# EAGLE design DmxI2C (EAGLE 6.1)
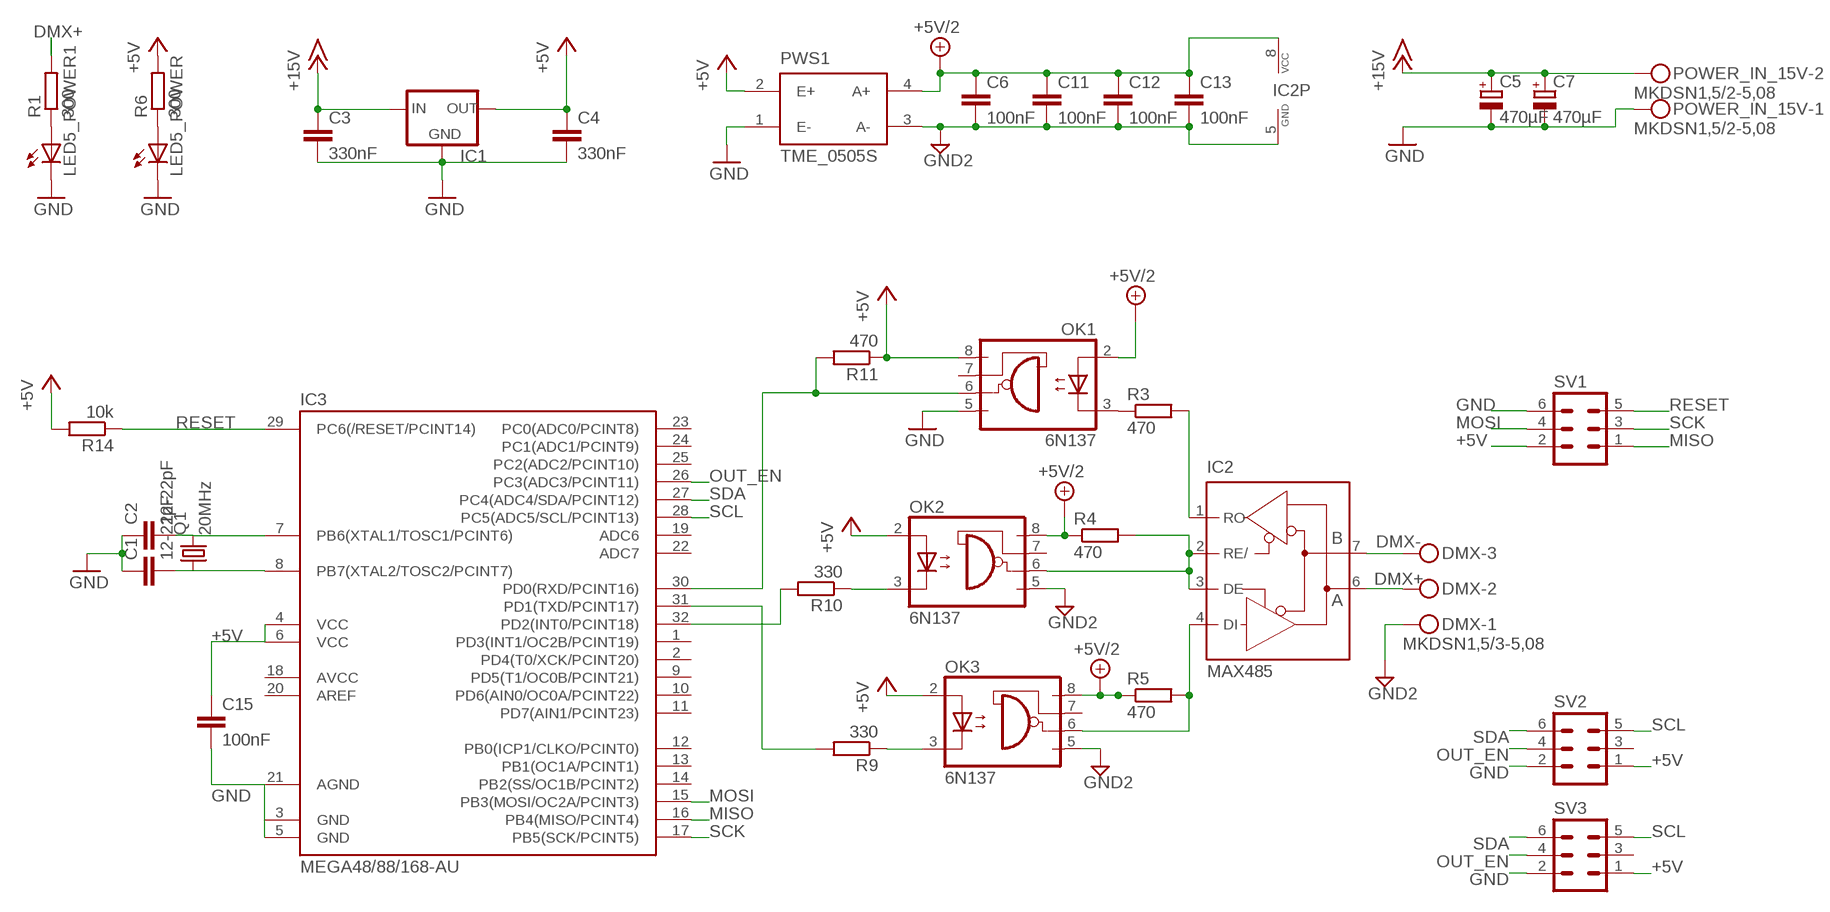
[diagram p0: schematic, sheet 1]

## Parts
C1  12-22pF  C-EUC0805  [C0805]
C2  12-22pF  C-EUC0805  [C0805]
C3  330nF  C-EUC0805  [C0805]
C4  330nF  C-EU050-025X075  [C050-025X075]
C5  470µF  CPOL-EUE2.5-6  [E2,5-6]
C6  100nF  C-EUC0805  [C0805]
C7  470µF  CPOL-EUE2.5-6  [E2,5-6]
C11  100nF  C-EUC0805  [C0805]
C12  100nF  C-EUC0805  [C0805]
C13  100nF  C-EUC0805  [C0805]
C15  100nF  C-EUC0805  [C0805]
DMX  MKDSN1,5/3-5,08  [MKDSN1,5/3-5,08]
IC1  78XXL  [78XXL]
IC2  MAX485  MAX481CPA  [DIL08]
IC3  MEGA48/88/168-AU  [TQFP32-08]
LED5_POWER  LED3MM  [LED3MM]
LED5_POWER1  LED3MM  [LED3MM]
OK1  6N137  [DIL08]
OK2  6N137  [DIL08]
OK3  6N137  [DIL08]
POWER_IN_15V  MKDSN1,5/2-5,08  [MKDSN1,5/2-5,08]
PWS1  TME_0505S  [TMEXXXXS]
Q1  20MHz  CRYSTALHC49UP  [HC49UP]
R1  300  R-EU_R0805  [R0805]
R3  470  R-EU_R0805  [R0805]
R4  470  R-EU_R0805  [R0805]
R5  470  R-EU_R0805  [R0805]
R6  300  R-EU_R0805  [R0805]
R9  330  R-EU_R0805  [R0805]
R10  330  R-EU_R0805  [R0805]
R11  470  R-EU_R0805  [R0805]
R14  10k  R-EU_R0805  [R0805]
SV1  MA03-2  [MA03-2]
SV2  MA03-2  [MA03-2]
SV3  MA03-2  [MA03-2]

## Nets
+5V [+5V]: C4.1 C15.1 IC1.OUT IC3.4(VCC) IC3.6(VCC) OK1.8(VCC) OK2.2(A) OK3.2(A) PWS1.2(E+) R6.2 R11.1 R14.2 SV1.2 SV2.1 SV3.1
+5V/2 [+5V]: C6.1 C11.1 C12.1 C13.1 IC2.8(VCC) OK1.2(A) OK2.8(VCC) OK3.8(VCC) PWS1.4(A+) R4.1 R5.1
+15V [+15V]: C3.1 C5.+ C7.+ IC1.IN POWER_IN_15V.2
DMX+ [dmx]: DMX.2 IC2.6(A) R1.2
DMX- [dmx]: DMX.3 IC2.7(B)
GND [GND]: C1.1 C2.1 C3.2 C4.2 C5.- C7.- C15.2 IC1.GND IC3.21(AGND) LED5_POWER1.K(C) LED5_POWER.K(C) OK1.5(GND) POWER_IN_15V.1 PWS1.1(E-) SV1.6 SV2.2 SV3.2
GND2 [GND]: C6.2 C11.2 C12.2 C13.2 DMX.1 IC2.5(GND) OK2.5(GND) OK3.5(GND) PWS1.3(A-)
MISO: IC3.16(PB4(MISO/PCINT4)) SV1.1
MOSI: IC3.15(PB3(MOSI/OC2A/PCINT3)) SV1.4
N$1: OK1.3(C) R3.1
N$2: IC2.1(RO) R3.2
N$3: IC2.2(RE/) IC2.3(DE) OK2.6(VO) R4.2
N$4: IC2.4(DI) OK3.6(VO) R5.2
N$5: OK3.3(C) R9.1
N$6: OK2.3(C) R10.1
N$7: IC3.30(PD0(RXD/PCINT16)) OK1.6(VO) R11.2
N$8: IC3.32(PD2(INT0/PCINT18)) R10.2
N$9: C2.2 IC3.7(PB6(XTAL1/TOSC1/PCINT6)) Q1.2
N$10: LED5_POWER1.A R1.1
N$12: IC3.31(PD1(TXD/PCINT17)) R9.2
N$18: C1.2 IC3.8(PB7(XTAL2/TOSC2/PCINT7)) Q1.1
N$20: LED5_POWER.A R6.1
OUT_EN: IC3.26(PC3(ADC3/PCINT11)) SV2.4 SV3.4
RESET: IC3.29(PC6(/RESET/PCINT14)) R14.1 SV1.5
SCK: IC3.17(PB5(SCK/PCINT5)) SV1.3
SCL: IC3.28(PC5(ADC5/SCL/PCINT13)) SV2.5 SV3.5
SDA: IC3.27(PC4(ADC4/SDA/PCINT12)) SV2.6 SV3.6
Unconnected: IC3.1(PD3(INT1/OC2B/PCINT19)) IC3.2(PD4(T0/XCK/PCINT20)) IC3.9(PD5(T1/OC0B/PCINT21)) IC3.10(PD6(AIN0/OC0A/PCINT22)) IC3.11(PD7(AIN1/PCINT23)) IC3.12(PB0(ICP1/CLKO/PCINT0)) IC3.13(PB1(OC1A/PCINT1)) IC3.14(PB2(SS/OC1B/PCINT2)) IC3.18(AVCC) IC3.19(ADC6) IC3.20(AREF) IC3.22(ADC7) IC3.23(PC0(ADC0/PCINT8)) IC3.24(PC1(ADC1/PCINT9)) IC3.25(PC2(ADC2/PCINT10)) OK1.7(VE) OK2.7(VE) OK3.7(VE) SV2.3 SV3.3

## Power pins joined to a net without a drawn wire
GND: IC3.3(GND) IC3.5(GND)

## Library data of the parts
C1-C4 C6 C11-C13 C15 = rcl:C-EU: CAPACITOR, European symbol
C5 C7 = rcl:CPOL-EU: POLARIZED CAPACITOR, European symbol
DMX = con-phoenix-508:MKDSN1,5/3-5,08: MKDSN 1,5/ 3-5,08 Printklemme Nennstrom: 13,5 A Nennspannung: 250 V Rastermaß: 5,08 mm Polzahl: 3 Anschlussart: Schraubanschluss Montage: Löten Anschlussrichtung Leiter/Platine: 0 ° Artikelnummer: 1729131 Source: http://eshop.phoenixcontact.com .. 1729131.pdf; MPN: SMKDSN1,5/3-5,08; OC_FARNELL: 1792904; OC_NEWARK: 70R0299
IC1 = v-reg:78XXL: VOLTAGE REGULATOR
IC2 = maxim:MAX481CPA: RS485 TRANSEIVER; MPN: MAX485; OC_FARNELL: unknown; OC_NEWARK: 99K3445
IC3 = avr-6:MEGA48/88/168
LED5_POWER LED5_POWER1 = led:LED: LED OSRAM: - CHIPLED LG R971, LG N971, LY N971, LG Q971, LY Q971, LO R971, LY R971 LH N974, LH R974 LS Q976, LO Q976, LY Q976 LO Q996 - Hyper CHIPLED LW Q18S LB Q993, LB Q99A, LB R99A - SideLED LS A670, LO A670, LY A670, LG A670, LP A670 LB A673, LV A673, LT A673, LW A673 LH A674 LY A675 LS A676, LA A676, LO A676, LY A676, LW A676 LS A679, LY A679, LG A679 - Hyper Micro SIDELED® LS Y876, LA Y876, LO Y876, LY Y876 LT Y87S - SmartLED LW L88C, LW L88S LB L89C, LB L89S, LG L890 LS L89K, LO L89K, LY L89K LS L896, LA L896, LO L896, LY L896 - TOPLED LS T670, LO T670, LY T670, LG T670, LP T670 LSG T670, LSP T670, LSY T670, LOP T670, LYG T670 LG T671, LOG T671, LSG T671 LB T673, LV T673, LT T673, LW T673 LH T674 LS T676, LA T676, LO T676, LY T676, LB T676, LH T676, LSB T676, LW T676 LB T67C, LV T67C, LT T67C, LS T67K, LO T67K, LY T67K, LW E67C LS E67B, LA E67B, LO E67B, LY E67B, LB E67C, LV E67C, LT E67C LW T67C LS T679, LY T679, LG T679 LS T770, LO T770, LY T770, LG T770, LP T770 LB T773, LV T773, LT T773, LW T773 LH T774 LS E675, LA E675, LY E675, LS T675 LS T776, LA T776, LO T776, LY T776, LB T776 LHGB T686 LT T68C, LB T68C - Hyper Mini TOPLED® LB M676 - Mini TOPLED Santana® LG M470 LS M47K, LO M47K, LY M47K Source: http://www.osram.convergy.de LUXEON: - LUMILED® LXK2-PW12-R00, LXK2-PW12-S00, LXK2-PW14-U00, LXK2-PW14-V00 LXK2-PM12-R00, LXK2-PM12-S00, LXK2-PM14-U00 LXK2-PE12-Q00, LXK2-PE12-R00, LXK2-PE12-S00, LXK2-PE14-T00, LXK2-PE14-U00 LXK2-PB12-K00, LXK2-PB12-L00, LXK2-PB12-M00, LXK2-PB14-N00, LXK2-PB14-P00, LXK2-PB14-Q00 LXK2-PR12-L00, LXK2-PR12-M00, LXK2-PR14-Q00, LXK2-PR14-R00 LXK2-PD12-Q00, LXK2-PD12-R00, LXK2-PD12-S00 LXK2-PH12-R00, LXK2-PH12-S00 LXK2-PL12-P00, LXK2-PL12-Q00, LXK2-PL12-R00 Source: www.luxeon.com KINGBRIGHT: KA-3528ASYC Source: www.kingbright.com
OK1-OK3 = optocoupler:6N137: MOTOROLA OPTO COUPLER; MPN: 6N137; OC_FARNELL: 1328376; OC_NEWARK: 52M1895
POWER_IN_15V = con-phoenix-508:MKDSN1,5/2-5,08: MKDSN 1,5/ 2-5,08 Printklemme Nennstrom: 13,5 A Nennspannung: 250 V Rastermaß: 5,08 mm Polzahl: 2 Anschlussart: Schraubanschluss Montage: Löten Anschlussrichtung Leiter/Platine: 0 ° Artikelnummer: 1729128 Source: http://eshop.phoenixcontact.com .. 1729128.pdf; MPN: MKDSN 1,5/2-5.08; OC_FARNELL: 1792903; OC_NEWARK: 30M2397
PWS1 = traco-electronic:TME_*S: DC/DC Konverter 1 Watt Source: http://www.tracopower.com/datasheet_g/tme-d.pdf; MPN: TME 0505S; OC_FARNELL: 1007538; OC_NEWARK: 51R5321
Q1 = adafruit:CRYSTAL: CRYSTAL; OC_FARNELL: unknown; OC_NEWARK: unknown
R1 R3-R6 R9-R11 R14 = rcl:R-EU_: RESISTOR, European symbol
SV1-SV3 = con-lstb:MA03-2: PIN HEADER; OC_FARNELL: unknown; OC_NEWARK: unknown

## Net classes
0 default: width 0.406 mm, drill 0.254 mm, clearance 0.254 mm
1 +5V: width 0.813 mm, drill 0.406 mm, clearance 0.406 mm
2 +15V: width 0.813 mm, drill 0.406 mm, clearance 0.406 mm
3 screw: clearance 1.016 mm
4 dmx: width 0.508 mm, drill 0.254 mm, clearance 0.406 mm
5 GND: width 0.813 mm, drill 0.406 mm, clearance 0.406 mm

## Board
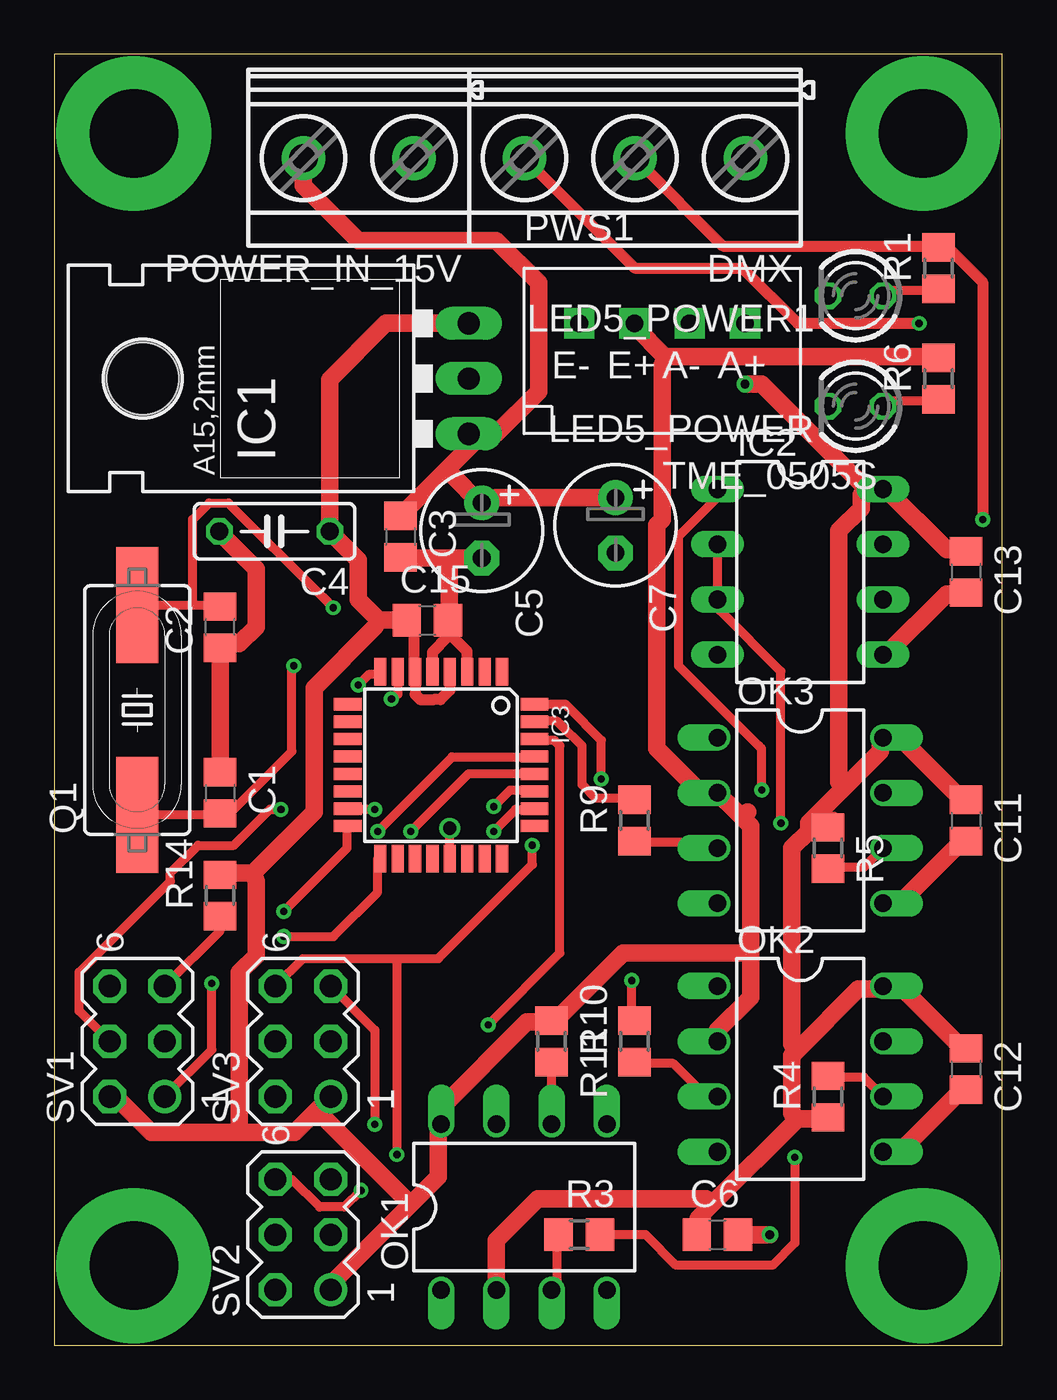
[diagram p1: board, top side]
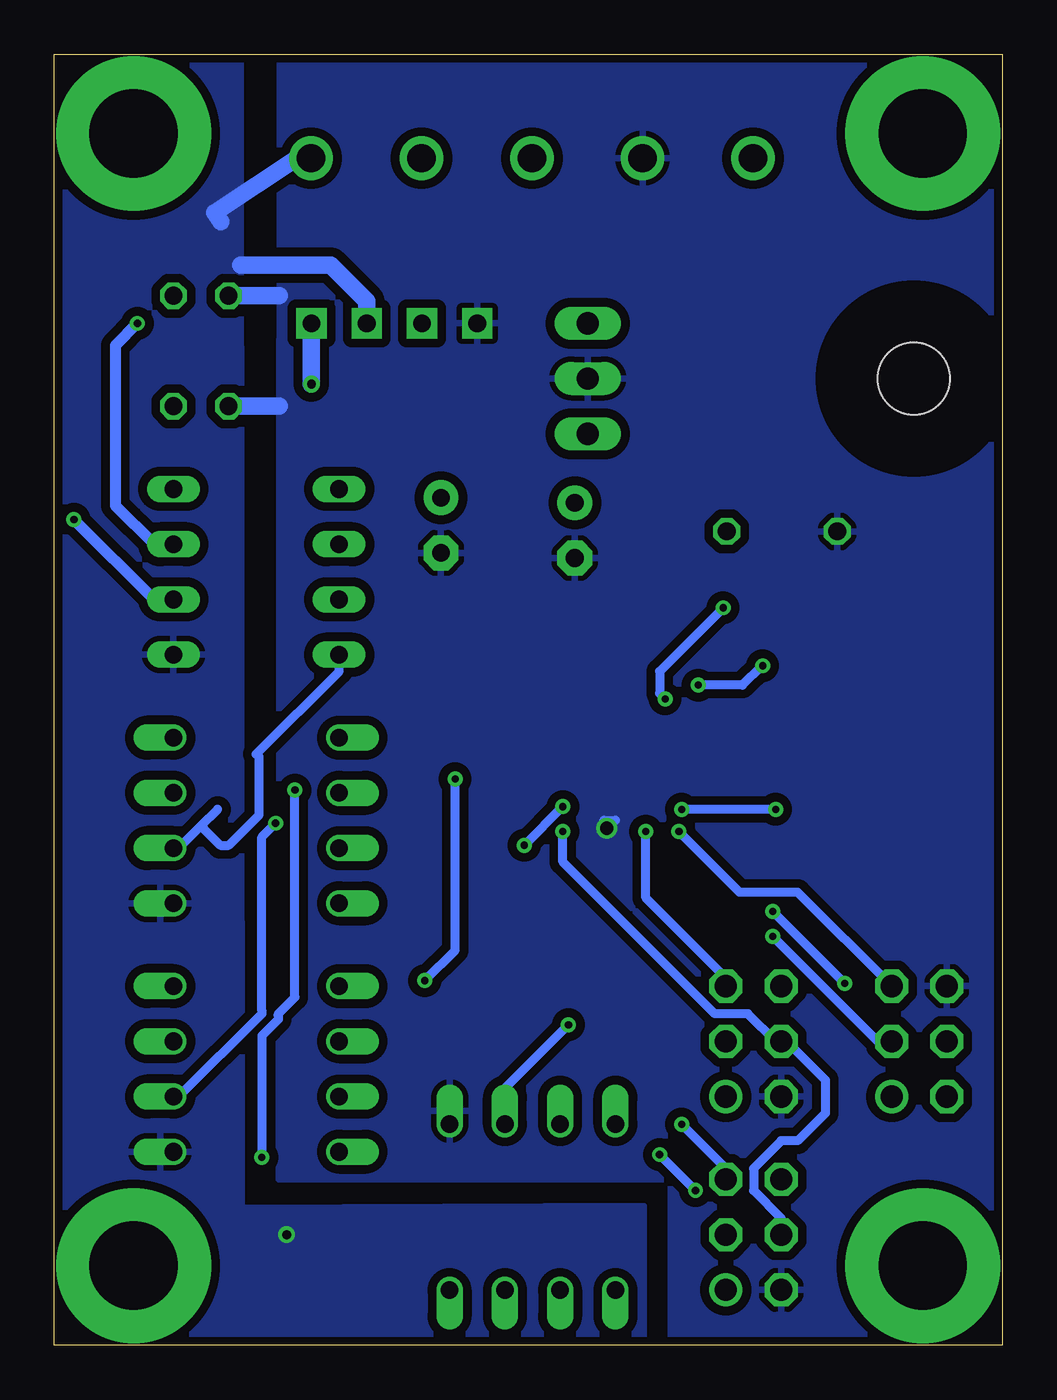
[diagram p2: board, bottom side, seen from below]

Size 43.57 x 59.36 mm. Coordinates in mm from the lower left corner, seen from the top.
Outline: 0,0 43.57,0 43.57,59.36 0,59.36 0,0
Copper layers (1*16): Top 0.0356mm / dielectric 1.5011mm / Bottom 0.0356mm
Design rules: minimum track width 16mil, minimum drill 13mil, track to track 6mil, track to pad 1mil, pad to pad 6mil, via to via 6mil, smd to smd 6mil, copper to edge 15mil, drill to drill 6mil, minimum pad ring 7mil, minimum via ring 7mil, stop-mask expansion 3mil, vias tented up to drill 0mil, thermal gap 10mil
vRestrict: area 0.6,39.2 to 16.6,49.8

### Footprints (pad centres in the part's own frame; a part is rotated, then mirrored left to right if it is on the bottom)
C0805 = smd 1.3 x 1.5: 1 -0.95,0; 2 0.95,0
C050-025X075 = drill 0.813 octagon: 1 -2.54,0; 2 2.54,0
E2,5-6 = drill 0.813 pad 1.6: + -1.27,0 | drill 0.813 pad 1.6 octagon: - 1.27,0
MKDSN1,5/3-5,08 = drill 1.3 pad 2: 1 -7.641,0.025; 2 -2.561,0.025; 3 2.519,0.025
78XXL = drill 1.016 long: GND 0,-3.81; IN -2.54,-3.81; OUT 2.54,-3.81 | hole 3.302: 0,11.176
DIL08 = drill 0.813 long: 1 -3.81,-3.81; 2 -1.27,-3.81; 3 1.27,-3.81; 4 3.81,-3.81; 5 3.81,3.81; 6 1.27,3.81; 7 -1.27,3.81; 8 -3.81,3.81
TQFP32-08 = smd 1.27 x 0.559: 1 -4.293,2.8; 2 -4.293,2; 3 -4.293,1.2; 4 -4.293,0.4; 5 -4.293,-0.4; 6 -4.293,-1.2; 7 -4.293,-2; 8 -4.293,-2.8; 17 4.293,-2.8; 18 4.293,-2; 19 4.293,-1.2; 20 4.293,-0.4; 21 4.293,0.4; 22 4.293,1.2; 23 4.293,2; 24 4.293,2.8 | smd 0.559 x 1.27: 9 -2.8,-4.293; 10 -2,-4.293; 11 -1.2,-4.293; 12 -0.4,-4.293; 13 0.4,-4.293; 14 1.2,-4.293; 15 2,-4.293; 16 2.8,-4.293; 25 2.8,4.293; 26 2,4.293; 27 1.2,4.293; 28 0.4,4.293; 29 -0.4,4.293; 30 -1.2,4.293; 31 -2,4.293; 32 -2.8,4.293
LED3MM = drill 0.813 octagon: A -1.27,0; K 1.27,0
DIL08' = drill 0.813 offset: 1 -3.81,-3.81; 2 -1.27,-3.81; 3 1.27,-3.81; 4 3.81,-3.81; 5 3.81,3.81; 6 1.27,3.81; 7 -1.27,3.81; 8 -3.81,3.81
MKDSN1,5/2-5,08 = drill 1.3 pad 2: 1 -2.561,0.025; 2 2.519,0.025
TMEXXXXS = drill 0.813 pad 1.397 square: 1 -3.81,1.27; 2 -1.27,1.27; 3 1.27,1.27; 4 3.81,1.27
HC49UP = smd 5.334 x 1.93: 1 -4.826,0; 2 4.826,0
R0805 = smd 1.3 x 1.5: 1 -0.95,0; 2 0.95,0
MA03-2 = drill 1.016: 1 -2.54,-1.27 | drill 1.016 octagon: 2 -2.54,1.27; 3 0,-1.27; 4 0,1.27; 5 2.54,-1.27; 6 2.54,1.27

### Placement (x,y rotation side)
C1  7.62,25.4 270 top
C2  7.62,33.02 90 top
C3  15.91,37.19 270 top
C4  10.12,37.43 180 top
C5  19.65,37.47 270 top
C6  30.48,5.08 0 top
C7  25.8,37.7 270 top
C11  41.91,24.13 270 top
C12  41.91,12.7 270 top
C13  41.91,35.56 270 top
C15  17.14,33.34 0 top
DMX  24.13,54.61 180 top
IC1  15.24,44.45 90 top
IC2  34.29,35.56 270 top
IC3  17.78,26.67 270 top
LED5_POWER  36.83,43.18 180 top
LED5_POWER1  36.83,48.26 180 top
OK1  6N137  [DIL08']  21.59,6.35 0 top
OK2  6N137  [DIL08']  34.29,12.7 270 top
OK3  6N137  [DIL08']  34.29,24.13 270 top
POWER_IN_15V  13.97,54.61 180 top
PWS1  27.94,45.72 0 top
Q1  3.81,29.21 90 top
R1  40.64,49.53 90 top
R3  24.13,5.08 0 top
R4  35.56,11.43 90 top
R5  35.56,22.86 270 top
R6  40.64,44.45 90 top
R9  26.67,24.13 90 top
R10  26.67,13.97 90 top
R11  22.86,13.97 270 top
R14  7.62,20.68 90 top
SV1  3.81,13.97 90 top
SV2  11.43,5.08 90 top
SV3  11.43,13.97 90 top

### Tracks (layer width: path | path; a pad name or v marks a point on that pad's centre or on a via)
+5V
  Top 0.508: C15.1 16.2,33.26 16.55,32.9 16.55,30.99 IC3.6 16.59,29.92 16.83,29.69 17.42,29.69 17.74,29.69 18.18,30.12 IC3.4
  Top 0.813: IC1.OUT 15.24,46.99 12.66,44.41 C4.1 13.97,36.12 13.97,34.29 14.92,33.34 | 14.92,33.34 C15.1 | 9.14,21.72 7.62,21.72 R14.2 | 9.14,21.72 11.94,24.51 11.94,30.23 14.73,33.02 14.92,33.34 | SV1.2 2.79,11.43 4.45,9.78 8.51,9.78 | 8.51,9.78 11.05,9.78 12.06,10.79 | SV3.1 12.06,10.79 | OK2.2 30.48,14.48 32,16 32,18.03 | 32,18.03 32,23.88 31.62,24.26 | SV2.1 12.7,2.79 16.38,6.48 | 16.38,6.48 17.65,7.75 17.65,9.78 OK1.8 17.78,10.92 21.72,14.86 22.86,14.86 R11.1 23.24,15.11 26.16,18.03 31.62,18.03 32,18.03 | 31.88,24.51 31.62,24.26 | 12.06,10.79 12.32,10.54 16.13,6.73 16.38,6.48 | 9.14,21.72 9.27,21.34 9.27,17.91 8.51,17.14 8.51,10.16 8.51,9.78 | 31.62,24.26 31.37,24.51 OK3.2 30.1,25.53 29.59,25.53 27.69,27.43 27.69,27.81 27.69,37.72 27.94,37.97 27.94,45.09 28.07,45.47 | 28.07,45.47 40.64,45.47 R6.2 | 28.07,45.47 26.67,46.86 PWS1.2
+5V/2  (via drill 0.41)
  Top 0.813: R5.1 35.56,23.75 R5.1 | 35.81,24.13 R5.1 | C12.1 41.91,13.72 41.66,13.72 38.86,16.51 OK2.8 37.72,16.38 36.96,16.38 34.16,13.59 | 34.16,10.41 30.23,6.48 | 30.23,6.48 29.59,5.84 29.59,5.08 C6.1 | 34.16,10.41 35.56,10.41 R4.1 | OK1.2 20.32,4.83 22.23,6.73 29.97,6.73 30.23,6.48 | 34.16,13.59 33.91,13.34 33.91,10.67 34.16,10.41 | 34.67,23.62 35.18,23.62 R5.1 | 34.67,23.62 33.91,22.86 33.91,13.84 34.16,13.59 | C11.1 41.91,25.15 41.66,25.15 38.86,27.94 OK3.8 37.97,27.56 37.97,27.3 36.32,25.65 | 36.32,25.65 34.67,24 34.67,23.62 | IC2.8 38.23,39.37 41.02,36.58 41.91,36.58 C13.1 | v31.75,44.2 32.51,44.2 37.21,39.5 37.72,39.5 IC2.8 | IC2.8 37.08,39.12 37.08,38.48 36.07,37.47 36.07,25.91 36.32,25.65
  Bottom 0.813: v31.75,44.2 PWS1.4
+15V
  Top 0.813: POWER_IN_15V.2 11.45,53.32 13.97,50.8 20.32,50.8 22.27,48.85 22.27,45.72 22.27,43.85 20.32,41.91 IC1.IN 19.3,41.53 18.03,40.26 | 18.03,40.26 16,38.23 C3.1 | C5.+ 19.56,38.73 18.29,40.01 18.03,40.26 | 19.94,38.99 C5.+ | C5.+ 20.32,38.99 20.7,38.99 25.78,38.99 C7.+
DMX+  (via drill 0.33)
  Top 0.508: DMX.2 26.8,54.48 30.73,50.55 40.64,50.55 R1.2 40.77,50.29 41.27,50.29 42.67,48.9 v42.67,37.97
  Bottom 0.508: IC2.6 38.99,34.29 v42.67,37.97
DMX-  (via drill 0.33)
  Top 0.508: v39.75,46.99 34.16,46.99 31.62,49.53 26.67,49.53 21.72,54.48 DMX.3
  Bottom 0.508: IC2.7 38.99,36.83 40.77,38.61 40.77,45.97 v39.75,46.99
GND  (via drill 0.6)
  Top 0.406: IC3.21 v18.18,23.77
  Top 0.508: IC3.5 17.38,31.87 18.09,32.58 | 18.09,32.58 C15.2 | IC3.3 18.97,30.97 18.97,31.91 18.3,32.58 18.09,32.58
  Top 0.813: C1.1 7.62,26.42 7.62,32 C2.1 8,32.26 8.51,32.26 9.27,33.02 9.27,35.69 7.62,37.34 C4.2 | 18.16,36.2 19.56,36.2 C5.- | 18.16,36.2 16,36.2 C3.2 | C15.2 18.16,33.53 18.16,35.81 18.16,36.2
  Bottom 0.406: v18.18,23.77 18.34,23.93 18.34,24.09 18.3,24.13 17.78,24.13
  Bottom 0.813: LED5_POWER.K 33.27,43.18 33.23,43.18 | LED5_POWER1.K 33.27,48.26 33.23,48.26
  pour Bottom (isolate 0.305): 0.16,0.16 0.16,59.17 33.22,59.17 33.26,7.62 15.24,7.62 15.24,0.16
GND2  (via drill 0.41)
  Top 0.813: v32.89,5.08 31.5,5.08 C6.2 | OK2.5 38.86,8.89 41.66,11.68 41.91,11.68 C12.2 | OK3.5 38.86,20.32 41.66,23.11 41.91,23.11 C11.2 | IC2.5 38.23,31.75 41.02,34.54 41.91,34.54 C13.2
  Bottom 0.813: PWS1.3 29.21,48.01 30.86,49.66 34.92,49.66 35,49.66 | DMX.1 31.88,54.61 32.38,54.61 36.2,52.07 35.92,51.67
  pour Bottom (isolate 0.305): 35,59.17 43.42,59.17 43.42,0.16 16.47,0.16 16.47,6.4 34.96,6.32
MISO  (via drill 0.33)
  Top 0.406: v10.54,19.94 13.46,22.86 13.46,23.75 IC3.16 | v7.24,16.64 7.24,13.59 SV1.1
  Bottom 0.406: v7.24,16.64 v10.54,19.94
MOSI  (via drill 0.33)
  Top 0.406: v14.73,24.64 13.59,24.64 IC3.15 | v10.41,24.64 9.91,24.64 8.26,22.99 6.6,22.99 5.33,21.72 5.33,21.34 1.14,17.14 1.14,15.37 SV1.4
  Bottom 0.406: v10.41,24.64 v14.73,24.64
N$1
  Top 0.406: OK1.3 23.11,2.79 23.11,5.08 R3.1
N$2  (via drill 0.33)
  Top 0.406: v34.04,8.64 34.04,4.7 33.02,3.68 28.57,3.68 27.18,5.08 25.15,5.08 R3.2 | v32.51,25.53 32.51,27.43 32.38,27.56 28.7,31.24 28.7,37.21 30.48,38.99 IC2.1
  Bottom 0.406: v34.04,8.64 34.04,14.22 33.27,14.99 33.27,15.11 33.27,15.24 32.51,16 v32.51,25.53
N$3  (via drill 0.33)
  Top 0.406: OK2.6 37.21,12.32 35.56,12.32 R4.2 | IC2.2 IC2.3 30.61,34.16 30.61,33.78 33.4,30.99 v33.4,24
  Bottom 0.406: OK2.6 37.85,11.43 34.04,15.24 34.04,15.37 34.04,23.37 v33.4,24
N$4
  Top 0.406: OK3.6 37.21,21.97 35.56,21.97 R5.2
  Bottom 0.406: 36.83,23.88 37.85,22.86 OK3.6 | 36.83,23.88 36.07,24.64 | 36.83,23.88 36.7,23.75 35.94,22.99 35.56,22.99 34.16,24.38 34.16,27.05 34.29,27.18 30.48,30.99 IC2.4
N$5
  Top 0.406: OK3.3 30.23,23.11 26.67,23.11 R9.1
N$6
  Top 0.406: OK2.3 29.97,11.43 28.45,12.95 26.67,12.95 R10.1
N$7  (via drill 0.33)
  Top 0.406: v19.94,14.73 23.24,18.03 23.24,27.56 22.99,27.81 22.1,27.81 IC3.30 | OK1.6 22.86,12.95 R11.2
  Bottom 0.406: v19.94,14.73 22.86,11.81 OK1.6
N$8  (via drill 0.33)
  Top 0.406: v26.54,16.76 26.54,15.11 26.67,14.99 R10.2 | IC3.32 22.1,29.46 23.5,29.46 23.62,29.34 25.15,27.81 v25.15,26.04
  Bottom 0.406: v25.15,26.04 25.15,18.16 v26.54,16.76
N$9  (via drill 0.33)
  Top 0.406: Q1.2 6.35,34.04 | 6.35,34.04 7.62,34.04 C2.2 | IC3.7 15.8,30.95 15.8,29.92 15.62,29.84 v15.49,29.72 | 6.35,34.04 6.35,34.16 6.35,37.97 7.11,38.73 8,38.73 12.19,34.54 12.32,34.42 v12.83,33.91
  Bottom 0.406: v15.49,29.72 15.75,29.97 15.75,30.99 v12.83,33.91
N$10
  Top 0.406: LED5_POWER1.A 38.35,48.51 40.64,48.51 R1.1
N$12
  Top 0.406: IC3.31 22.1,28.7 23.11,28.7 23.24,28.57 24.26,27.56 24.26,25.78 24.89,25.15 26.67,25.15 R9.2
N$18  (via drill 0.33)
  Top 0.406: v13.97,30.35 14.48,30.86 14.86,30.86 IC3.8 | 8.13,24.51 7.62,24.51 C1.2 | Q1.1 7.49,24.38 C1.2 | v11.01,31.24 10.92,31.24 10.92,27.3 8.26,24.64 C1.2
  Bottom 0.406: v13.97,30.35 11.94,30.35 11.05,31.24 v11.01,31.24
N$20
  Top 0.406: LED5_POWER.A 38.35,43.43 40.64,43.43 R6.1
N$21  (via drill 4.06 pad 7.11)
  other vias: 39.93,3.65
N$34  (via drill 4.06 pad 7.11)
  other vias: 3.65,3.65
N$35  (via drill 4.06 pad 7.11)
  other vias: 39.93,55.72
N$36  (via drill 4.06 pad 7.11)
  other vias: 3.65,55.72
OUT_EN  (via drill 0.33)
  Top 0.406: v20.19,23.62 21.21,24.64 21.97,24.64 IC3.26
  Bottom 0.406: v20.19,23.62 20.19,22.23 13.21,15.24 11.68,15.24 10.41,13.97 SV3.4 10.03,14.1 8.13,12.19 8.13,10.67 9.4,9.4 10.16,9.4 11.43,8.13 11.43,7.11 10.16,5.84 SV2.4
RESET  (via drill 0.33)
  Top 0.406: v14.86,23.62 18.29,27.05 21.97,27.05 IC3.29 | SV1.5 7.62,19.05 7.62,19.68 R14.1
  Bottom 0.406: v14.86,23.62 12.06,20.83 9.4,20.83 SV1.5
SCK  (via drill 0.33)
  Top 0.406: v10.54,18.8 12.83,18.8 14.86,20.83 14.86,22.35 IC3.17
  Bottom 0.406: v10.54,18.8 5.71,13.97 SV1.3
SCL  (via drill 0.33)
  Top 0.406: v14.73,10.16 14.73,14.48 SV3.5 | v16.38,23.62 19.05,26.29 21.97,26.29 IC3.28
  Bottom 0.406: SV2.5 12.7,8.13 v14.73,10.16 | v16.38,23.62 16.38,20.57 12.7,16.89 SV3.5
SDA  (via drill 0.33)
  Top 0.406: v20.19,24.77 20.95,25.53 21.97,25.53 IC3.27 | v21.97,22.99 21.97,22.1 17.65,17.78 15.75,17.78 | 15.75,17.78 11.43,17.78 SV3.6 | SV2.6 10.92,7.62 12.19,6.35 13.34,6.35 v14.1,7.11 | v15.75,8.76 15.75,17.65 15.75,17.78
  Bottom 0.406: v21.97,22.99 v20.19,24.77 | v15.75,8.76 v14.1,7.11